# EAGLE design board (EAGLE 7.6.0)

## Sheet 1 of 2
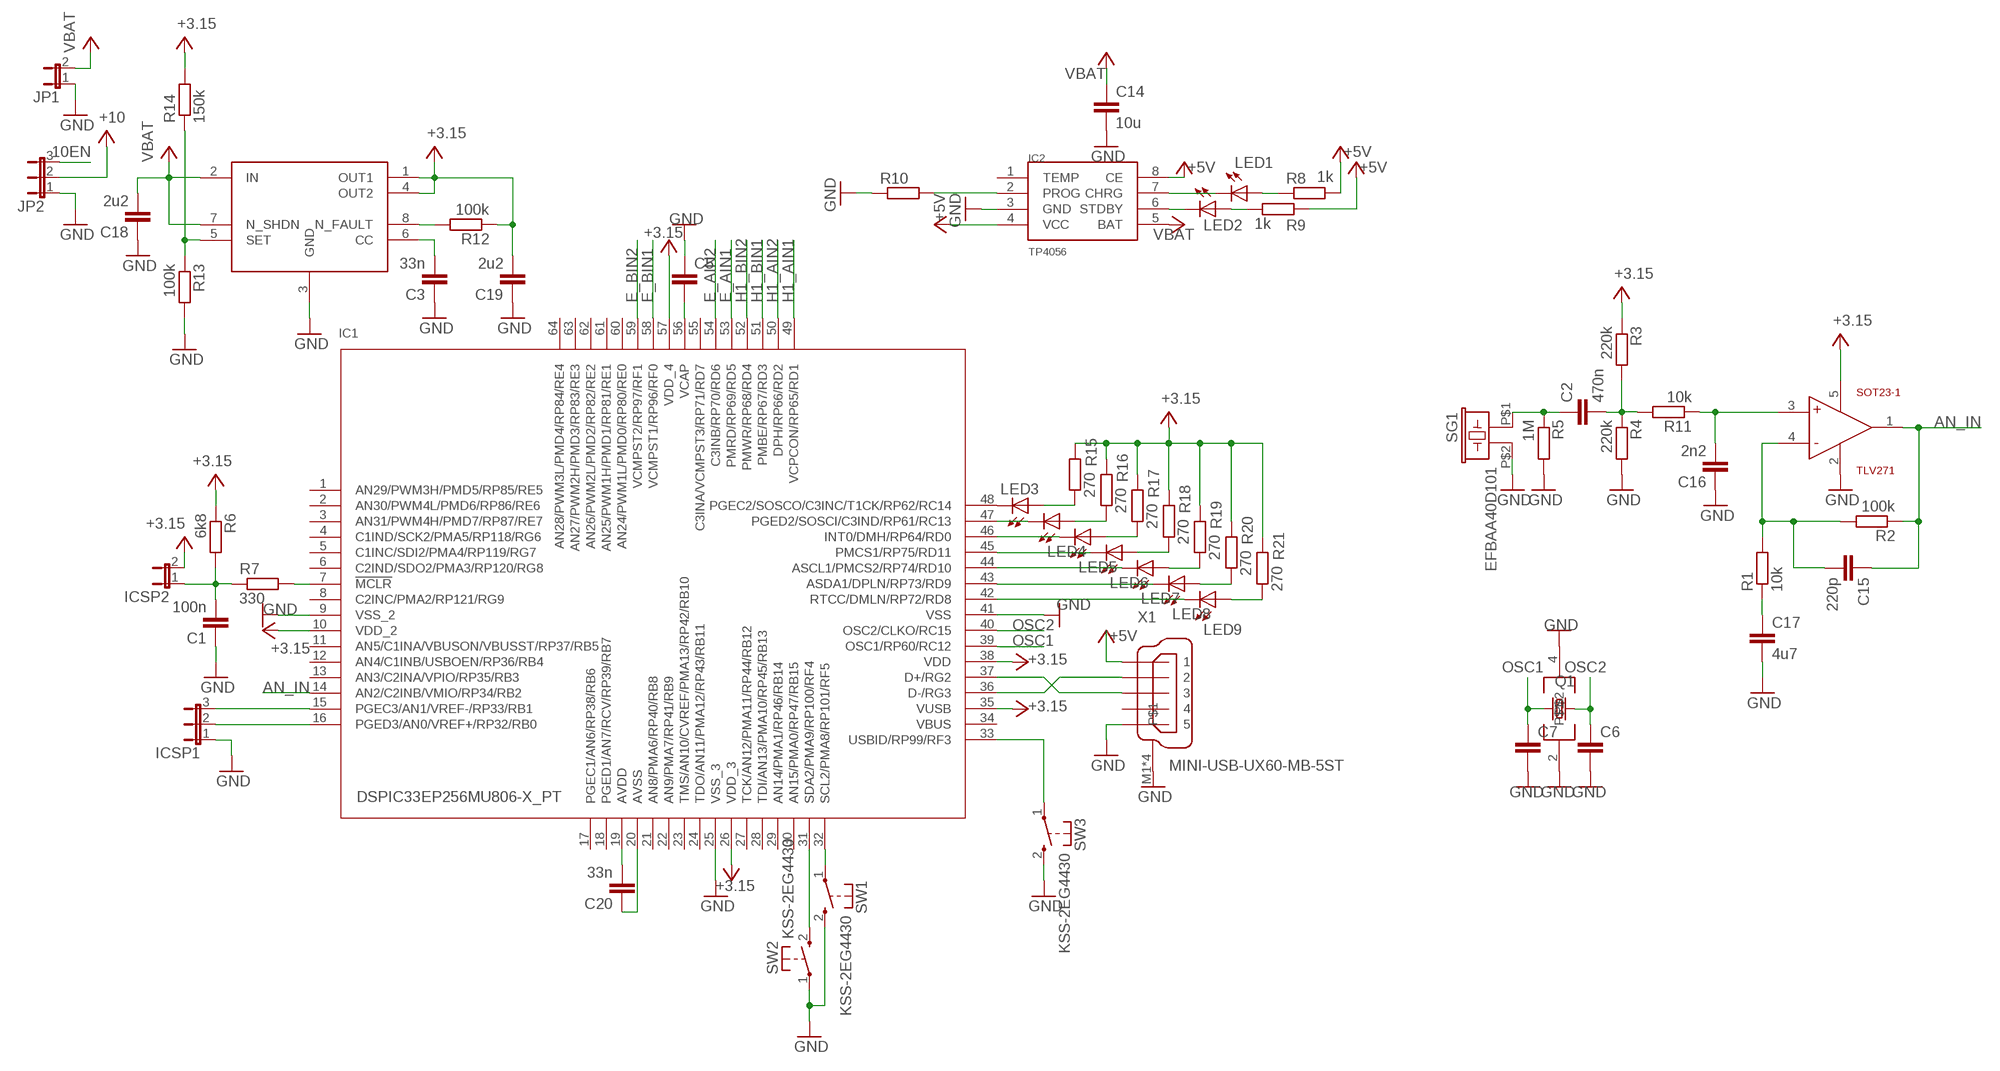
[diagram p0: schematic, sheet 1]

### Parts
C1  100n  CC0603  [C0603]
C2  470n  C  [C0805]
C3  33n  C  [C0805]
C5  CC1206  [C1206]
C6  C  [C0805]
C7  C  [C0805]
C14  10u  CC1206  [C1206]
C15  220p  C  [C0805]
C16  2n2  C  [C0805]
C17  4u7  CC1206  [C1206]
C18  2u2  C  [C0805]
C19  2u2  C  [C0805]
C20  33n  C  [C0805]
IC1  DSPIC33EP256MU806-X_PT  [QFP64-10X10MC]
IC2  TP4056  [SOP-8]
ICSP1  JP2E  [JP2]
ICSP2  JP1E  [JP1]
JP1  JP1E  [JP1]
JP2  JP2E  [JP2]
LED1  LED_ESML0603  [LED_SML0603]
LED2  LED_ESML0603  [LED_SML0603]
LED3  LED_ESML0603  [LED_SML0603]
LED4  LED_ESML0603  [LED_SML0603]
LED5  LED_ESML0603  [LED_SML0603]
LED6  LED_ESML0603  [LED_SML0603]
LED7  LED_ESML0603  [LED_SML0603]
LED8  LED_ESML0603  [LED_SML0603]
LED9  LED_ESML0603  [LED_SML0603]
Q1  CRYSTALCTS406  [CTS406]
R1  10k  R  [R0805]
R2  100k  R  [R0805]
R3  220k  R  [R0805]
R4  220k  R  [R0805]
R5  1M  R  [R0805]
R6  6k8  RR0603  [R0603]
R7  330  RR0603  [R0603]
R8  1k  R  [R0805]
R9  1k  R  [R0805]
R10  R  [R0805]
R11  10k  R  [R0805]
R12  100k  R  [R0805]
R13  100k  R  [R0805]
R14  150k  R  [R0805]
R15  270  R  [R0805]
R16  270  R  [R0805]
R17  270  R  [R0805]
R18  270  R  [R0805]
R19  270  R  [R0805]
R20  270  R  [R0805]
R21  270  R  [R0805]
SG1  EFBAA40D101  [EFBAA40D101]
SOT23-1  TLV271  [SOT23-5]
SW1  KSS-2EG4430  [KSS-2EG4430]
SW2  KSS-2EG4430  [KSS-2EG4430]
SW3  KSS-2EG4430  [KSS-2EG4430]
U$8  LP3982  [LP3982]
X1  MINI-USB-UX60-MB-5ST  [UX60-MB-5ST]

### Nets
10EN: JP2.3
+3.15: C19.2 IC1.10(VDD_2) IC1.26(VDD_3) IC1.35(VUSB) IC1.38(VDD) IC1.57(VDD_4) ICSP2.2 R6.1 R12.1 R14.2 U$8.1(OUT1) U$8.4(OUT2)
+3.15V: R3.1 R15.2 R16.2 R17.2 R18.2 R19.2 R20.2 R21.2 SOT23-1.5(VDD) ; supply symbol labelled +3.15 ; also sheet 2
+5V: IC2.4(VCC) IC2.8(CE) R8.2 R9.2 X1.1
+10: JP2.2
AN_IN: C15.1 IC1.14(AN2/C2INB/VMIO/RP34/RB2) R2.1 SOT23-1.1(OUT)
E_AIN1: IC1.53(PMRD/RP69/RD5) ; also sheet 2
E_AIN2: IC1.54(C3INB/RP70/RD6) ; also sheet 2
E_BIN1: IC1.58(VCMPST1/RP96/RF0) ; also sheet 2
E_BIN2: IC1.59(VCMPST2/RP97/RF1) ; also sheet 2
GND: C1.1 C3.1 C5.1 C6.2 C7.2 C14.2 C16.1 C17.2 C18.1 C19.1 IC1.9(VSS_2) IC1.25(VSS_3) IC1.41(VSS) IC2.3(GND) ICSP1.1 JP1.1 JP2.1 Q1.2 Q1.4 R4.2 R5.2 R10.1 R13.2 SG1.P$2 SOT23-1.2(GND) SW1.2(S) SW2.1(P) SW3.2(S) U$8.3(GND) X1.5 X1.M1 X1.M2 X1.M3 X1.M4 ; also sheet 2
H1_AIN1: IC1.49(VCPCON/RP65/RD1) ; also sheet 2
H1_AIN2: IC1.50(DPH/RP66/RD2) ; also sheet 2
H1_BIN1: IC1.51(PMBE/RP67/RD3) ; also sheet 2
H1_BIN2: IC1.52(PMWR/RP68/RD4) ; also sheet 2
N$1: IC1.36(D-/RG3) X1.2
N$2: IC1.37(D+/RG2) X1.3
N$3: C20.2 IC1.19(AVDD)
N$4: C20.1 IC1.20(AVSS)
N$5: IC1.7(!MCLR) R7.2
N$6: C5.2 IC1.56(VCAP)
N$11: IC1.48(PGEC2/SOSCO/C3INC/T1CK/RP62/RC14) LED3.C
N$12: C15.2 R1.2 R2.2 SOT23-1.4(IN-)
N$13: C17.1 R1.1
N$14: C2.2 R3.2 R4.1 R11.2
N$15: IC2.7(CHRG) LED1.C
N$16: C2.1 R5.1 SG1.P$1
N$21: IC2.6(STDBY) LED2.C
N$22: LED2.A R9.1
N$23: LED1.A R8.1
N$24: IC2.2(PROG) R10.2
N$25: C16.2 R11.1 SOT23-1.3(IN+)
N$26: R12.2 U$8.8(N_FAULT)
N$31: C3.2 U$8.6(CC)
N$32: LED4.A R16.1
N$33: R13.1 R14.1 U$8.5(SET)
N$34: LED5.A R17.1
N$42: LED6.A R18.1
N$43: LED7.A R19.1
N$44: LED8.A R20.1
N$45: LED9.A R21.1
N$46: LED3.A R15.1
N$51: IC1.47(PGED2/SOSCI/C3IND/RP61/RC13) LED4.C
N$52: IC1.42(RTCC/DMLN/RP72/RD8) LED9.C
N$53: IC1.43(ASDA1/DPLN/RP73/RD9) LED8.C
N$54: IC1.44(ASCL1/PMCS2/RP74/RD10) LED7.C
N$55: IC1.45(PMCS1/RP75/RD11) LED6.C
N$56: IC1.46(INT0/DMH/RP64/RD0) LED5.C
N$61: IC1.31(SDA2/PMA9/RP100/RF4) SW2.2(S)
N$62: IC1.32(SCL2/PMA8/RP101/RF5) SW1.1(P)
N$64: IC1.33(USBID/RP99/RF3) SW3.1(P)
OSC1: C7.1 IC1.39(OSC1/RP60/RC12) Q1.3
OSC2: C6.1 IC1.40(OSC2/CLKO/RC15) Q1.1
PGC: IC1.15(PGEC3/AN1/VREF-/RP33/RB1) ICSP1.3
PGD: IC1.16(PGED3/AN0/VREF+/RP32/RB0) ICSP1.2
RST: C1.2 ICSP2.1 R6.2 R7.1
VBAT: C14.1 C18.2 IC2.5(BAT) JP1.2 U$8.2(IN) U$8.7(N_SHDN) ; also sheet 2
Unconnected: IC1.1(AN29/PWM3H/PMD5/RP85/RE5) IC1.2(AN30/PWM4L/PMD6/RP86/RE6) IC1.3(AN31/PWM4H/PMD7/RP87/RE7) IC1.4(C1IND/SCK2/PMA5/RP118/RG6) IC1.5(C1INC/SDI2/PMA4/RP119/RG7) IC1.6(C2IND/SDO2/PMA3/RP120/RG8) IC1.8(C2INC/PMA2/RP121/RG9) IC1.11(AN5/C1INA/VBUSON/VBUSST/RP37/RB5) IC1.12(AN4/C1INB/USBOEN/RP36/RB4) IC1.13(AN3/C2INA/VPIO/RP35/RB3) IC1.17(PGEC1/AN6/RP38/RB6) IC1.18(PGED1/AN7/RCV/RP39/RB7) IC1.21(AN8/PMA6/RP40/RB8) IC1.22(AN9/PMA7/RP41/RB9) IC1.23(TMS/AN10/CVREF/PMA13/RP42/RB10) IC1.24(TDO/AN11/PMA12/RP43/RB11) IC1.27(TCK/AN12/PMA11/RP44/RB12) IC1.28(TDI/AN13/PMA10/RP45/RB13) IC1.29(AN14/PMA1/RP46/RB14) IC1.30(AN15/PMA0/RP47/RB15) IC1.55(C3INA/VCMPST3/RP71/RD7) IC1.60(AN24/PWM1L/PMD0/RP80/RE0) IC1.61(AN25/PWM1H/PMD1/RP81/RE1) IC1.62(AN26/PWM2L/PMD2/RP82/RE2) IC1.63(AN27/PWM2H/PMD3/RP83/RE3) IC1.64(AN28/PWM3L/PMD4/RP84/RE4) IC2.1(TEMP) X1.4

## Sheet 2 of 2
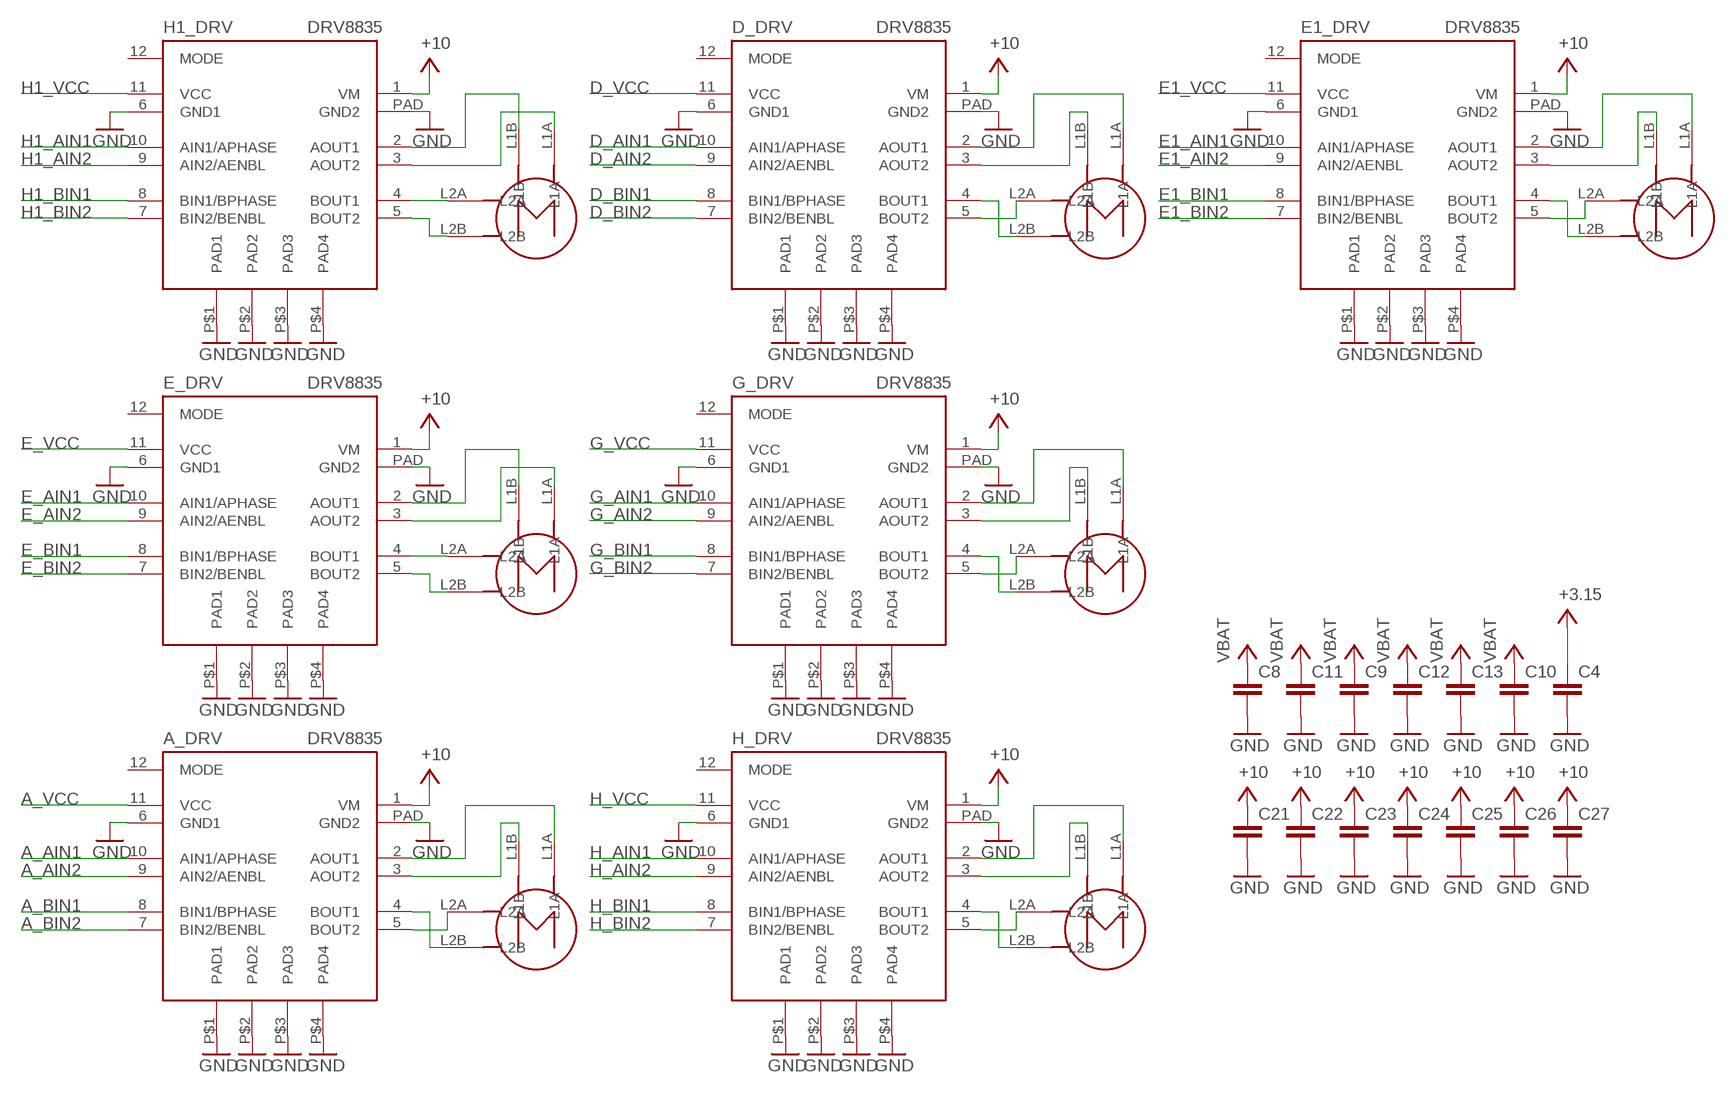
[diagram p1: schematic, sheet 2]

### Parts
A_DRV  DRV8835  [WSON_2X3]
C4  CC1206  [C1206]
C8  CC1206  [C1206]
C9  CC1206  [C1206]
C10  CC1206  [C1206]
C11  CC1206  [C1206]
C12  CC1206  [C1206]
C13  CC1206  [C1206]
C21  CC1206  [C1206]
C22  CC1206  [C1206]
C23  CC1206  [C1206]
C24  CC1206  [C1206]
C25  CC1206  [C1206]
C26  CC1206  [C1206]
C27  CC1206  [C1206]
D_DRV  DRV8835  [WSON_2X3]
E1_DRV  DRV8835  [WSON_2X3]
E_DRV  DRV8835  [WSON_2X3]
G_DRV  DRV8835  [WSON_2X3]
H1_DRV  DRV8835  [WSON_2X3]
H1šWF  H1  STEP_MOTOR  [STEP_MOTOR]
H_DRV  DRV8835  [WSON_2X3]
U$1  STEP_MOTOR_MIRROR  [STEP_MOTOR_MIRROR]
U$2  STEP_MOTOR_MIRROR  [STEP_MOTOR_MIRROR]
U$3  STEP_MOTOR_MIRROR  [STEP_MOTOR_MIRROR]
U$4  STEP_MOTOR  [STEP_MOTOR]
U$6  STEP_MOTOR  [STEP_MOTOR]
U$7  STEP_MOTOR_MIRROR  [STEP_MOTOR_MIRROR]

### Nets
+3.15V: C4.1 ; supply symbol labelled +3.15 ; also sheet 1
+10V: A_DRV.1(VM) C21.1 C22.1 C23.1 C24.1 C25.1 C26.1 C27.1 D_DRV.1(VM) E1_DRV.1(VM) E_DRV.1(VM) G_DRV.1(VM) H1_DRV.1(VM) H_DRV.1(VM) ; supply symbol labelled +10
A_AIN1: A_DRV.10(AIN1/APHASE)
A_AIN2: A_DRV.9(AIN2/AENBL)
A_BIN1: A_DRV.8(BIN1/BPHASE)
A_BIN2: A_DRV.7(BIN2/BENBL)
A_VCC: A_DRV.11(VCC)
D_AIN1: D_DRV.10(AIN1/APHASE)
D_AIN2: D_DRV.9(AIN2/AENBL)
D_BIN1: D_DRV.8(BIN1/BPHASE)
D_BIN2: D_DRV.7(BIN2/BENBL)
D_VCC: D_DRV.11(VCC)
E1_AIN1: E1_DRV.10(AIN1/APHASE)
E1_AIN2: E1_DRV.9(AIN2/AENBL)
E1_BIN1: E1_DRV.8(BIN1/BPHASE)
E1_BIN2: E1_DRV.7(BIN2/BENBL)
E1_VCC: E1_DRV.11(VCC)
E_AIN1: E_DRV.10(AIN1/APHASE) ; also sheet 1
E_AIN2: E_DRV.9(AIN2/AENBL) ; also sheet 1
E_BIN1: E_DRV.8(BIN1/BPHASE) ; also sheet 1
E_BIN2: E_DRV.7(BIN2/BENBL) ; also sheet 1
E_VCC: E_DRV.11(VCC)
G_AIN1: G_DRV.10(AIN1/APHASE)
G_AIN2: G_DRV.9(AIN2/AENBL)
G_BIN1: G_DRV.8(BIN1/BPHASE)
G_BIN2: G_DRV.7(BIN2/BENBL)
G_VCC: G_DRV.11(VCC)
GND: A_DRV.6(GND1) A_DRV.P$1(PAD1) A_DRV.P$2(PAD2) A_DRV.P$3(PAD3) A_DRV.P$4(PAD4) A_DRV.PAD(GND2) C4.2 C8.2 C9.2 C10.2 C11.2 C12.2 C13.2 C21.2 C22.2 C23.2 C24.2 C25.2 C26.2 C27.2 D_DRV.6(GND1) D_DRV.P$1(PAD1) D_DRV.P$2(PAD2) D_DRV.P$3(PAD3) D_DRV.P$4(PAD4) D_DRV.PAD(GND2) E1_DRV.6(GND1) E1_DRV.P$1(PAD1) E1_DRV.P$2(PAD2) E1_DRV.P$3(PAD3) E1_DRV.P$4(PAD4) E1_DRV.PAD(GND2) E_DRV.6(GND1) E_DRV.P$1(PAD1) E_DRV.P$2(PAD2) E_DRV.P$3(PAD3) E_DRV.P$4(PAD4) E_DRV.PAD(GND2) G_DRV.6(GND1) G_DRV.P$1(PAD1) G_DRV.P$2(PAD2) G_DRV.P$3(PAD3) G_DRV.P$4(PAD4) G_DRV.PAD(GND2) H1_DRV.6(GND1) H1_DRV.P$1(PAD1) H1_DRV.P$2(PAD2) H1_DRV.P$3(PAD3) H1_DRV.P$4(PAD4) H1_DRV.PAD(GND2) H_DRV.6(GND1) H_DRV.P$1(PAD1) H_DRV.P$2(PAD2) H_DRV.P$3(PAD3) H_DRV.P$4(PAD4) H_DRV.PAD(GND2) ; also sheet 1
H1_AIN1: H1_DRV.10(AIN1/APHASE) ; also sheet 1
H1_AIN2: H1_DRV.9(AIN2/AENBL) ; also sheet 1
H1_BIN1: H1_DRV.8(BIN1/BPHASE) ; also sheet 1
H1_BIN2: H1_DRV.7(BIN2/BENBL) ; also sheet 1
H1_VCC: H1_DRV.11(VCC)
H_AIN1: H_DRV.10(AIN1/APHASE)
H_AIN2: H_DRV.9(AIN2/AENBL)
H_BIN1: H_DRV.8(BIN1/BPHASE)
H_BIN2: H_DRV.7(BIN2/BENBL)
H_VCC: H_DRV.11(VCC)
N$7: D_DRV.2(AOUT1) U$2.L1A
N$8: D_DRV.3(AOUT2) U$2.L1B
N$9: D_DRV.5(BOUT2) U$2.L2A
N$10: D_DRV.4(BOUT1) U$2.L2B
N$17: E1_DRV.2(AOUT1) U$1.L1A
N$18: E1_DRV.3(AOUT2) U$1.L1B
N$19: E1_DRV.5(BOUT2) U$1.L2A
N$20: E1_DRV.4(BOUT1) U$1.L2B
N$27: G_DRV.2(AOUT1) U$3.L1A
N$28: G_DRV.3(AOUT2) U$3.L1B
N$29: G_DRV.5(BOUT2) U$3.L2A
N$30: G_DRV.4(BOUT1) U$3.L2B
N$35: E_DRV.5(BOUT2) U$4.L2B
N$37: E_DRV.2(AOUT1) U$4.L1B
N$38: E_DRV.3(AOUT2) U$4.L1A
N$40: E_DRV.4(BOUT1) U$4.L2A
N$47: H1_DRV.2(AOUT1) H1šWF.L1B
N$48: H1_DRV.3(AOUT2) H1šWF.L1A
N$49: H1_DRV.5(BOUT2) H1šWF.L2B
N$50: H1_DRV.4(BOUT1) H1šWF.L2A
N$57: A_DRV.2(AOUT1) U$6.L1A
N$58: A_DRV.3(AOUT2) U$6.L1B
N$59: A_DRV.5(BOUT2) U$6.L2A
N$60: A_DRV.4(BOUT1) U$6.L2B
N$67: H_DRV.2(AOUT1) U$7.L1A
N$68: H_DRV.3(AOUT2) U$7.L1B
N$69: H_DRV.5(BOUT2) U$7.L2A
N$70: H_DRV.4(BOUT1) U$7.L2B
VBAT: C8.1 C9.1 C10.1 C11.1 C12.1 C13.1 ; also sheet 1
Unconnected: A_DRV.12(MODE) D_DRV.12(MODE) E1_DRV.12(MODE) E_DRV.12(MODE) G_DRV.12(MODE) H1_DRV.12(MODE) H_DRV.12(MODE)

## Power pins joined to a net without a drawn wire
VBUS: IC1.34(VBUS)

## Library data of the parts
A_DRV D_DRV E1_DRV E_DRV G_DRV H1_DRV H_DRV = bt_motordriver:DRV8835: DRV8835 DUAL LOW VOLTAGE H-BRIDGE IC The DRV8835 provides an integrated motor driver solution for cameras, consumer products, toys, and other low voltage or battery-powered motion control applications. The device has two H-bridge drivers, and can drive two DC motors or one stepper motor, as well as other devices like solenoids. The device has two H-bridge drivers, and drives two DC motors or one stepper motor, as well as other devices like solenoids. The output driver block for each consists of N-channel power MOSFETs configured as an H-bridge to drive the motor winding. An internal charge pump generates gate drive voltages. 1.5-A Maximum Drive Current Per H-Bridge Configure Bridges Parallel for 3-A Drive Curren 0-V to 11-V Motor-Operating Supply-Voltage 2-V to 7-V Logic Supply-Voltage Flexible PWM or PHASE/ENABLE Interface Low-Power Sleep Mode With 95-nA Maximum Supply Current Tiny 2.00-mm × 3.00-mm WSON Package Reference: http://www.ti.com/lit/ds/symlink/drv8835.pdf
C1-C27 = eagle-ltspice:C: CAPACITOR, European symbol; SPICEMODEL: NONE; SPICEPREFIX: C
H1šWF U$4 U$6 = diplomka:STEP_MOTOR
IC1 = dspic33ep:DSPIC33EP256MU806-X_PT: dsPIC33EP256MU806-X_PT QFP64 10x10
IC2 = TP4056.lbr:TP4056
ICSP1 JP2 = jumper:JP2E: JUMPER
ICSP2 JP1 = jumper:JP1E: JUMPER
LED1-LED9 = eagle-ltspice:LED_E: LED Source: http://www.osram.convergy.de Source: www.luxeon.com Source: www.kingbright.com; SPICEMODEL: NONE; SPICEPREFIX: D; SPICETYPE: diode
Q1 = crystal:CRYSTAL: CRYSTAL; OC_FARNELL: unknown; OC_NEWARK: unknown
R1-R21 = eagle-ltspice:R: RESISTOR, European symbol; SPICEMODEL: NONE; SPICEPREFIX: R
SG1 = buzzer:EFB?: Piezoelectric Acoustic Transducer Source: Panbasonic .. 2SC1685.pdf; OC_FARNELL: unknown; OC_NEWARK: unknown
SOT23-1 = texas_instruments:TLV271: TLV271 Single channel 3mhz Op-Amp
SW1-SW3 = buttons:KSS-2EG4430: Size: 3x6mm Height: 5mm from PCB Rating: DC12v 50mA Travel: 0.25±0.10mm Operating Force: 180±50gf Return Force: 60gf min Contact resistance: 100m? max Insulation resistance: 100M? min Operating life?50,000 cycles
U$1-U$3 U$7 = diplomka:STEP_MOTOR_MIRROR
U$8 = diplomka:LP3982
X1 = con-hirose:MINI-USB-: MINI USB Connector Source: http://www.hirose.co.jp/cataloge_hp/e24000019.pdf; OC_FARNELL: unknown; OC_NEWARK: unknown

## Net classes
0 default: width 0.15 mm, drill 0.3 mm, clearance 0.15 mm

## Board
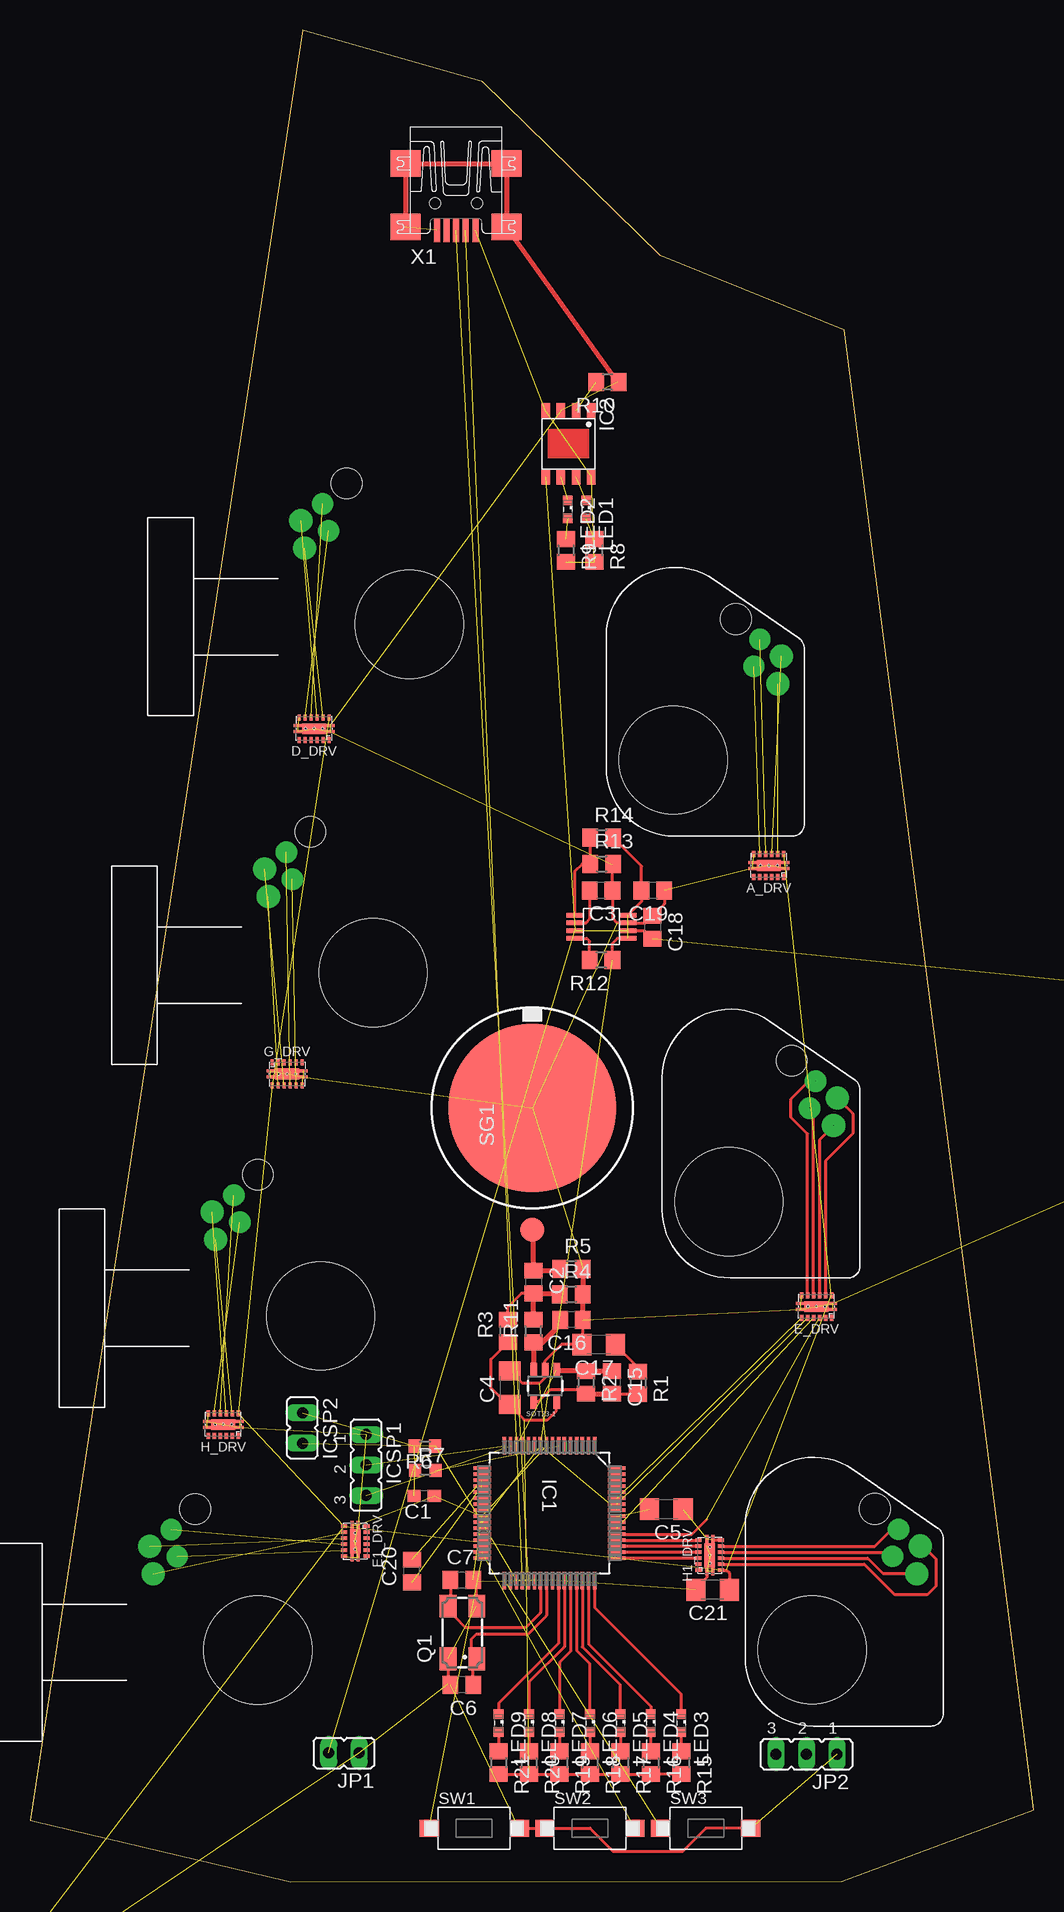
[diagram p2: board, top side]
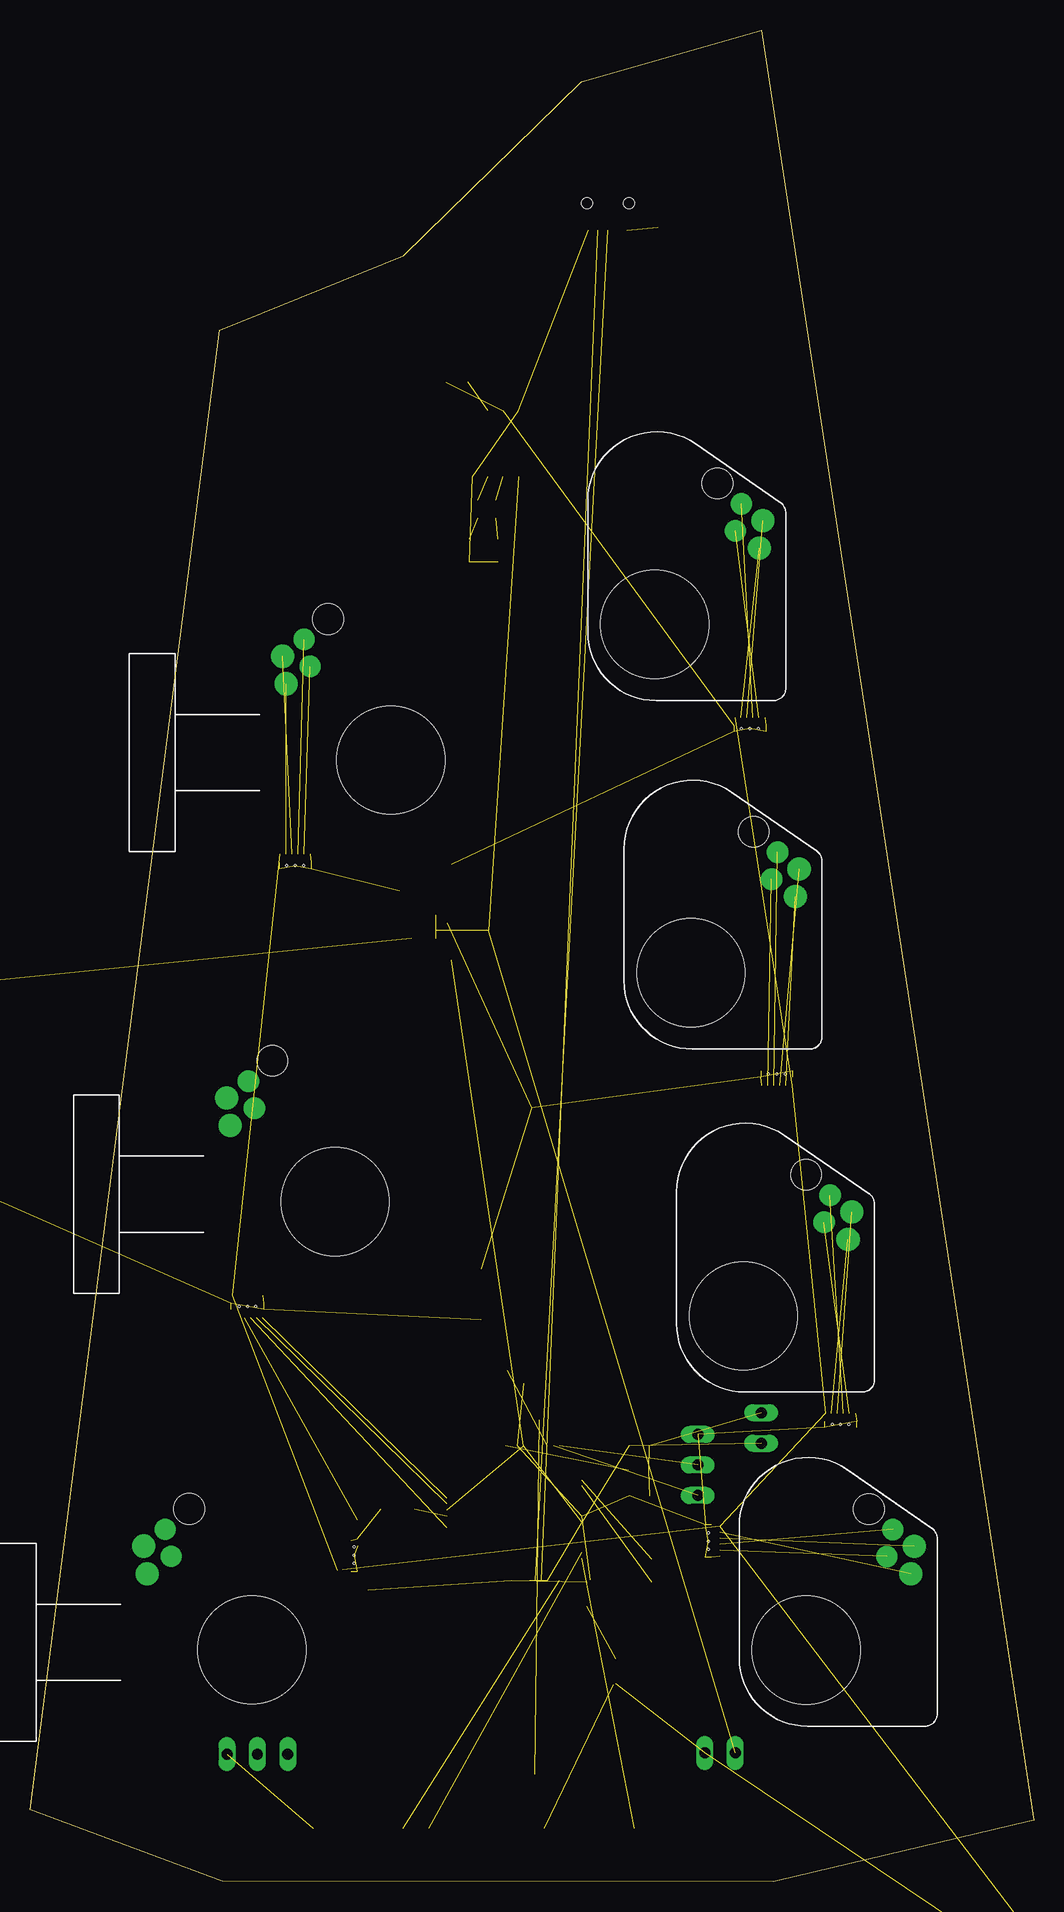
[diagram p3: board, bottom side, seen from below]

Size 83.7 x 154.36 mm. Coordinates in mm from the lower left corner, seen from the top.
Outline: 0,5.14 21.71,0 67.7,0.05 83.7,6.02 67.9,129.36 52.55,135.53 37.73,150.06 22.74,154.36 0,5.14
Copper layers (1*16): Top 0.035mm / dielectric 1.5mm / Bottom 0.035mm
Design rules "default": minimum track width 10mil, minimum drill 24mil, track to track 8mil, track to pad 8mil, pad to pad 8mil, via to via 8mil, smd to smd 8mil, copper to edge 40mil, drill to drill 8mil, minimum pad ring 10mil, minimum via ring 8mil, stop-mask expansion 4mil, vias tented up to drill 0mil, thermal gap 10mil

### Footprints (pad centres in the part's own frame; a part is rotated, then mirrored left to right if it is on the bottom)
WSON_2X3 = smd 0.28 x 0.5: 1 -1.25,-0.95; 2 -0.75,-0.95; 3 -0.25,-0.95; 4 0.25,-0.95; 5 0.75,-0.95; 6 1.25,-0.95; 7 1.25,0.95; 8 0.75,0.95; 9 0.25,0.95; 10 -0.25,0.95; 11 -0.75,0.95; 12 -1.25,0.95 | smd 0.7 x 0.25: P$1 -1.35,0.25; P$2 -1.35,-0.25; P$3 1.35,-0.25; P$4 1.35,0.25 | smd 2 x 0.9: PAD 0,0 | hole 0.15: 0,0; -0.7,0; 0.7,0
C0603 = smd 1.1 x 1: 1 -0.85,0; 2 0.85,0
C0805 = smd 1.3 x 1.5: 1 -0.95,0; 2 0.95,0
C1206 = smd 1.6 x 1.8: 1 -1.4,0; 2 1.4,0
STEP_MOTOR = drill 0 pad 1.93: L1A 6.35,-8.73; L1B 8.65,-9.03 | drill 0 pad 1.778: L2A 7.8,-6.73; L2B 10.05,-7.23 | hole 9: 0,0 | hole 2.54: 11.75,-5.23
QFP64-10X10MC = smd 1.473 x 0.279: 1 -5.613,3.759; 2 -5.613,3.251; 3 -5.613,2.743; 4 -5.613,2.261; 5 -5.613,1.753; 6 -5.613,1.245; 7 -5.613,0.762; 8 -5.613,0.254; 9 -5.613,-0.254; 10 -5.613,-0.762; 11 -5.613,-1.245; 12 -5.613,-1.753; 13 -5.613,-2.261; 14 -5.613,-2.743; 15 -5.613,-3.251; 16 -5.613,-3.759; 33 5.613,-3.759; 34 5.613,-3.251; 35 5.613,-2.743; 36 5.613,-2.261; 37 5.613,-1.753; 38 5.613,-1.245; 39 5.613,-0.762; 40 5.613,-0.254; 41 5.613,0.254; 42 5.613,0.762; 43 5.613,1.245; 44 5.613,1.753; 45 5.613,2.261; 46 5.613,2.743; 47 5.613,3.251; 48 5.613,3.759 | smd 0.279 x 1.473: 17 -3.759,-5.613; 18 -3.251,-5.613; 19 -2.743,-5.613; 20 -2.261,-5.613; 21 -1.753,-5.613; 22 -1.245,-5.613; 23 -0.762,-5.613; 24 -0.254,-5.613; 25 0.254,-5.613; 26 0.762,-5.613; 27 1.245,-5.613; 28 1.753,-5.613; 29 2.261,-5.613; 30 2.743,-5.613; 31 3.251,-5.613; 32 3.759,-5.613; 49 3.759,5.613; 50 3.251,5.613; 51 2.743,5.613; 52 2.261,5.613; 53 1.753,5.613; 54 1.245,5.613; 55 0.762,5.613; 56 0.254,5.613; 57 -0.254,5.613; 58 -0.762,5.613; 59 -1.245,5.613; 60 -1.753,5.613; 61 -2.261,5.613; 62 -2.743,5.613; 63 -3.251,5.613; 64 -3.759,5.613
SOP-8 = smd 1.3 x 0.7: 1 -2.75,1.905; 2 -2.75,0.635; 3 -2.75,-0.635; 4 -2.75,-1.905; 5 2.75,-1.905; 6 2.75,-0.635; 7 2.75,0.635; 8 2.75,1.905
JP2 = drill 0.914 long: 1 -2.54,0; 2 0,0; 3 2.54,0
JP1 = drill 0.914 long: 1 0,-1.27; 2 0,1.27
LED_SML0603 = smd 0.8 x 0.8: A 0.75,0; C -0.75,0
CTS406 = smd 1.9 x 1.4: 1 -2.2,-1.2; 2 2.2,-1.2; 3 2.2,1.2; 4 -2.2,1.2
R0805 = smd 1.3 x 1.5: 1 -0.95,0; 2 0.95,0
R0603 = smd 1 x 1.1: 1 -0.85,0; 2 0.85,0
EFBAA40D101 = smd 2 x 2: P$1 -10.16,0 | smd 14 x 14: P$2 0,0
SOT23-5 = smd 0.55 x 1.2: 1 0.32,1.24; 2 1.27,1.24; 3 2.22,1.24; 4 2.22,3.84; 5 0.32,3.84
KSS-2EG4430 = smd 1.6 x 1.4: 1 -3.75,0; 2 3.75,0
STEP_MOTOR_MIRROR = drill 0 pad 1.93: L1A -6.35,-8.73; L1B -8.65,-9.03 | drill 0 pad 1.778: L2A -7.8,-6.73; L2B -10.05,-7.23 | hole 2.54: -11.75,-5.23 | hole 9: 0,0
LP3982 = smd 1.45 x 0.38: 1 -2.2,0.975; 2 -2.2,0.325; 3 -2.2,-0.325; 4 -2.2,-0.975; 5 2.2,-0.975; 6 2.2,-0.325; 7 2.2,0.325; 8 2.2,0.975
UX60-MB-5ST = smd 2 x 0.5: 1 2.25,1.6; 2 2.25,0.8; 3 2.25,0; 4 2.25,-0.8; 5 2.25,-1.6 | smd 2.2 x 2.5: M1 -3.3,-4.2; M2 -3.3,4.2; M3 2,4.2; M4 2,-4.2 | hole 0.9: 0,-1.75; 0,1.75

### Placement (x,y rotation side)
A_DRV  61.6,84.7 180 top
C1  32.86,32.16 180 top
C2  41.98,50 270 top
C3  47.61,82.64 180 top
C4  40.01,41.18 90 top
C5  53.05,31.05 180 top
C6  36.01,16.41 180 top
C7  36.01,25.17 0 top
C8  120.98,90.53 0 top  (outside the outline)
C9  121.05,99.14 0 top  (outside the outline)
C10  121.12,93.68 0 top  (outside the outline)
C11  121.12,87.64 0 top  (outside the outline)
C12  121.12,81.61 0 top  (outside the outline)
C13  121.12,75.58 0 top  (outside the outline)
C14  119.47,71.96 0 top  (outside the outline)
C15  48.51,41.63 270 top
C16  45.14,46.86 180 top
C17  47.41,44.78 180 top
C18  51.88,79.56 270 top
C19  51.93,82.64 180 top
C20  31.84,25.91 90 top
C21  56.91,24.34 180 top
C22  -0.3,-6.96 0 top  (outside the outline)
C23  -0.3,-10.97 0 top  (outside the outline)
C24  -0.3,-14.97 0 top  (outside the outline)
C25  -0.3,-18.97 0 top  (outside the outline)
C26  -0.3,-22.97 0 top  (outside the outline)
C27  -0.3,-26.97 0 top  (outside the outline)
D_DRV  23.68,96.11 180 top
E1_DRV  27.12,28.39 270 top
E_DRV  65.57,47.94 180 top
G_DRV  21.43,67.35 0 top
H1_DRV  56.67,27.23 90 top
H1šWF  65.2,19.33 90 top
H_DRV  16.12,38.11 180 top
IC1  43.31,30.73 270 top
IC2  44.89,119.87 270 top
ICSP1  28.02,34.75 270 top
ICSP2  22.72,37.83 180 top
JP1  26.17,10.73 90 top
JP2  64.74,10.63 180 top
LED1  46.36,114.4 270 top
LED2  44.84,114.4 270 top
LED3  54.31,13.23 270 top
LED4  51.77,13.23 270 top
LED5  49.23,13.23 270 top
LED6  46.69,13.23 270 top
LED7  44.15,13.23 270 top
LED8  41.61,13.23 270 top
LED9  39.07,13.23 270 top
Q1  36.04,20.78 90 top
R1  50.68,41.58 270 top
R2  46.36,41.63 270 top
R3  39.85,45.92 90 top
R4  45.13,48.98 0 top
R5  45.15,51.1 0 top
R6  32.92,36.32 180 top
R7  32.95,34.3 0 top
R8  47.06,110.97 270 top
R9  44.68,110.97 270 top
R10  48.14,125 180 top
R11  41.98,45.91 90 top
R12  47.61,76.83 180 top
R13  47.66,84.85 0 top
R14  47.66,87.04 0 top
R15  54.31,9.93 270 top
R16  51.77,9.93 270 top
R17  49.23,9.93 270 top
R18  46.69,9.93 270 top
R19  44.15,9.93 270 top
R20  41.61,9.93 270 top
R21  39.07,9.93 270 top
SG1  41.88,64.5 90 top
SOT23-1  44.22,43.88 180 top
SW1  37.03,4.47 0 top
SW2  46.69,4.47 0 top
SW3  56.34,4.47 0 top
U$1  19,19.32 270 top
U$2  31.62,104.81 270 top
U$3  28.6,75.77 270 top
U$4  58.27,56.68 90 top
U$6  53.62,93.5 90 top
U$7  24.22,47.18 270 top
U$8  47.65,79.61 180 top
X1  35.53,139.93 270 top

### Tracks (layer width: path | path; a pad name or v marks a point on that pad's centre or on a via)
+3.15  (8 unrouted)
  Top 0.254: 50.37,80.54 50.32,80.58 U$8.4 50.98,81.71 C19.2 50.98,84.67 R14.2 | R12.1 48.56,78.23 48.97,78.63 U$8.1
+3.15V  (1 unrouted)
  Top 0.254: SOT23-1.5 43.89,40.03 43.89,39.26 43.13,38.5 41.23,38.5 40.01,39.72 C4.1 39.82,39.78 38.43,41.17 38.43,43.55 R3.1 | R21.2 R20.2 R19.2 R18.2 R17.2 R16.2 R15.2
+5V  (4 unrouted)
+10V  (12 unrouted)
  Top 0.254: 57.67,25.99 H1_DRV.1 58.06,25.98 58.31,25.74 C21.1
AN_IN  (1 unrouted)
  Top 0.406: SOT23-1.1 46.3,42.64 R2.1 C15.1
E_AIN1  (1 unrouted)
  Top 0.254: IC1.53 55.2,28.98 56.4,30.18
E_AIN2  (1 unrouted)
E_BIN1  (1 unrouted)
E_BIN2  (1 unrouted)
GND  (70 unrouted)
  Top 0.254: Q1.4 34.84,16.5 C6.2 | Q1.2 37.24,25.01 C7.2 | R13.2 48.56,84.8 C3.1 48.59,82.61 48.59,80.28 48.94,79.93 U$8.3 51.31,79.93 C18.1 52.88,81.51 C19.1 | C4.2 41.04,41.55 42.5,41.55 42.95,42.01 SOT23-1.2 42.95,43.41 44.33,44.78 C17.2 46.08,44.84 46.08,46.87 | SW1.2 SW2.1 46.7,4.47 48.61,2.56 54.44,2.56 56.34,4.47 SW3.2 | H1_DRV.P$4 56.42,28.05 56.4,28.02 | H1_DRV.P$1 56.42,25.38 55.83,24.79 55.83,24.66 C21.2 | H1_DRV.6 56.92,28.48 H1_DRV.P$3
  Top 0.406: R5.2 46.1,49 R4.2 46.08,46.87 C16.1 | X1.M4 X1.M1 X1.M2 X1.M3 49,125 R10.1
H1_AIN1
  Top 0.254: H1_DRV.10 48.93,26.98 IC1.49
H1_AIN2
  Top 0.254: H1_DRV.9 IC1.50 | IC1.50
H1_BIN1
  Top 0.254: IC1.51 H1_DRV.8
H1_BIN2
  Top 0.254: IC1.52 55.71,28.47 H1_DRV.7
N$1  (1 unrouted)
N$2  (1 unrouted)
N$3  (1 unrouted)
N$4  (1 unrouted)
N$5  (1 unrouted)
N$6  (1 unrouted)
N$7  (1 unrouted)
N$8  (1 unrouted)
N$9  (1 unrouted)
N$10  (1 unrouted)
N$11
  Top 0.254: LED3.C 54.31,15.64 47.07,22.88 IC1.48
N$12
  Top 0.254: R1.2 48.55,40.64 C15.2 | SOT23-1.4 42.38,40.04 43.38,41.04 46,41.04 R2.2
  Top 0.406: R2.2 C15.2
N$13
  Top 0.254: 50.59,42.62 R1.1 50.68,42.89 48.81,44.76 C17.1
N$14
  Top 0.254: C2.2 40.98,49.05 39.83,47.9 39.83,46.89 R3.2
  Top 0.406: R11.2 C2.2 44.11,49.05 R4.1
N$15  (1 unrouted)
N$16
  Top 0.406: R5.1 44.05,50.95 C2.1 41.98,54.24 SG1.P$1
N$17  (1 unrouted)
N$18  (1 unrouted)
N$19  (1 unrouted)
N$20  (1 unrouted)
N$21  (1 unrouted)
N$22  (1 unrouted)
N$23  (1 unrouted)
N$24  (1 unrouted)
N$25
  Top 0.406: SOT23-1.3 42,44.94 R11.1 42.73,44.96 43.89,46.12 43.89,46.56 C16.2
N$26
  Top 0.254: R12.2 46.66,78.4 46.43,78.63 U$8.8
N$27  (1 unrouted)
N$28  (1 unrouted)
N$29  (1 unrouted)
N$30  (1 unrouted)
N$31
  Top 0.254: U$8.6 46.34,79.93 46.69,80.28 46.69,82.62 C3.2
N$32
  Top 0.254: R16.1 LED4.A
N$33
  Top 0.254: R14.1 R13.1 46.04,84.85 45.45,84.26 U$8.5
N$34
  Top 0.254: LED5.A R17.1
N$35
  Top 0.254: U$4.L2B 64.95,66.73 63.45,65.23 63.45,63.71 64.82,62.34 E_DRV.5
N$37
  Top 0.254: U$4.L1B 68.59,64.04 68.59,62.38 66.32,60.1 E_DRV.2
N$38
  Top 0.254: U$4.L1A 65.82,61.85 E_DRV.3
N$40
  Top 0.254: E_DRV.4 65.32,64.17 U$4.L2A
N$42
  Top 0.254: LED6.A R18.1
N$43
  Top 0.254: LED7.A R19.1
N$44
  Top 0.254: LED8.A R20.1
N$45
  Top 0.254: LED9.A R21.1
N$46
  Top 0.254: R15.1 LED3.A
N$47
  Top 0.254: H1šWF.L1B 74.44,27.98 75.5,26.92 75.5,24.62 74.8,23.92 72.1,23.92 69.54,26.48 H1_DRV.2
N$48
  Top 0.254: H1_DRV.3 69.84,26.98 71.14,25.68 H1šWF.L1A
N$49
  Top 0.254: H1_DRV.5 70.46,27.98 71.86,29.38 H1šWF.L2B
N$50
  Top 0.254: H1_DRV.4 71.58,27.48 H1šWF.L2A
N$51
  Top 0.254: IC1.47 46.56,19.83 51.77,14.63 LED4.C
N$52
  Top 0.254: IC1.42 44.07,19.89 39.07,14.88 LED9.C
N$53
  Top 0.254: IC1.43 44.56,19.61 41.61,16.66 LED8.C
N$54
  Top 0.254: IC1.44 45.06,19.23 44.15,18.31 LED7.C
N$55
  Top 0.254: LED6.C 46.69,18.18 45.57,19.3 IC1.45
N$56
  Top 0.254: LED5.C 49.23,16.4 46.05,19.57 IC1.46
N$57  (1 unrouted)
N$58  (1 unrouted)
N$59  (1 unrouted)
N$60  (1 unrouted)
N$61  (1 unrouted)
N$62  (1 unrouted)
N$64  (1 unrouted)
N$67  (1 unrouted)
N$68  (1 unrouted)
N$69  (1 unrouted)
N$70  (1 unrouted)
OSC1
  Top 0.254: C7.1 35.06,23.19 Q1.3 35.38,22.12 36.33,21.18 41.3,21.18 42.55,22.43 IC1.39
OSC2
  Top 0.254: C6.1 36.96,18.29 Q1.1 36.78,19.45 36.78,20.21 37.23,20.67 41.55,20.67 43.06,22.17 IC1.40
PGC  (1 unrouted)
PGD  (1 unrouted)
RST  (3 unrouted)
VBAT  (10 unrouted)
  Top 0.254: U$8.2 51.21,79.28 C18.2